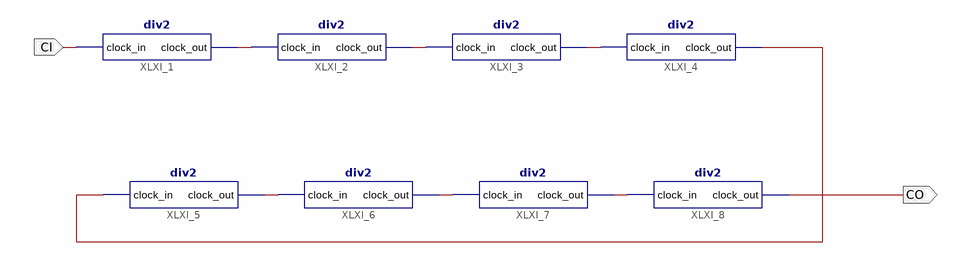
[diagram p0: schematic sheet 1]
// Xilinx ISE schematic DIV.sch (spartan6) as structural Verilog: 8 symbols, 2 ports
module DIV (
  input  CI,
  output CO
);

  wire XLXN_1, XLXN_2, XLXN_3, XLXN_4, XLXN_5, XLXN_6, XLXN_7;

  div2 XLXI_1 (.clock_in(CI), .clock_out(XLXN_1));
  div2 XLXI_2 (.clock_in(XLXN_1), .clock_out(XLXN_2));
  div2 XLXI_3 (.clock_in(XLXN_2), .clock_out(XLXN_3));
  div2 XLXI_4 (.clock_in(XLXN_3), .clock_out(XLXN_7));
  div2 XLXI_5 (.clock_in(XLXN_7), .clock_out(XLXN_4));
  div2 XLXI_6 (.clock_in(XLXN_4), .clock_out(XLXN_5));
  div2 XLXI_7 (.clock_in(XLXN_5), .clock_out(XLXN_6));
  div2 XLXI_8 (.clock_in(XLXN_6), .clock_out(CO));
endmodule
